# EAGLE design IncubaLibre (EAGLE 6.5.0)
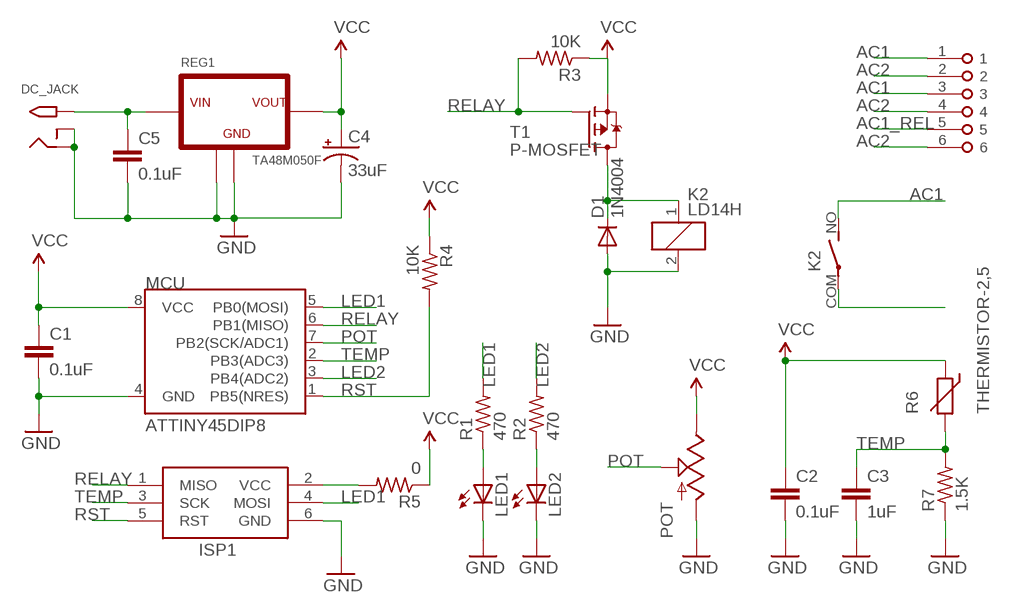
[diagram p0: schematic, sheet 1]

## Parts
AC  TERMINAL-6  [MBE-156]
C1  0.1uF  CAPPTH  [CAP-PTH-SMALL]
C2  0.1uF  CAPPTH  [CAP-PTH-SMALL]
C3  1uF  CAPPTH  [CAP-PTH-SMALL]
C4  33uF  CAP_POLPTH2  [CPOL-RADIAL-10UF-25V]
C5  0.1uF  CAPPTH  [CAP-PTH-SMALL]
D1  1N4004  [DO41-10]
DC_JACK  2.1MMJACKTHM  [PJ-102A]
ISP1  AVRISP-6  [AVRISP]
K2  LD14H  [LD]
LED1  LED5MM  [LED5MM]
LED2  LED5MM  [LED5MM]
MCU  ATTINY45DIP8  [DIP08]
POT  POTTRIM  [TRIM_POT]
R1  470  R-US_0204/7  [0204/7]
R2  470  R-US_0204/7  [0204/7]
R3  10K  R-US_0204/7  [0204/7]
R4  10K  R-US_0204/7  [0204/7]
R5  0  R-US_0204/7  [0204/7]
R6  THERMISTOR-2,5  [RS-2,5]
R7  1.5K  R-US_0204/7  [0204/7]
REG1  TA48M050F  REGULATOR-TO-220  [TO-220]
T1  P-MOSFET  [TO92-]

## Nets
AC1: AC.1 AC.3 K2.NO(2:S)
AC1_REL: AC.5 K2.COM(2:P)
AC2: AC.2 AC.4 AC.6
GND: C1.2 C2.2 C3.2 C4.2(-) C5.2 D1.A DC_JACK.RING DC_JACK.RING_SW ISP1.6(GND) K2.2 LED1.K(C) LED2.K(C) MCU.4(GND) POT.3(A) R7.1 REG1.CENTER(GND) REG1.THERMAL(GND)
LED1: ISP1.4(MOSI) MCU.5(PB0(MOSI)) R1.2
LED2: MCU.3(PB4(ADC2)) R2.2
N$1: ISP1.2(VCC) R5.2
N$2: LED1.A R1.1
N$5: LED2.A R2.1
N$9: C5.1 DC_JACK.TIP REG1.LEFT(VIN)
POT: MCU.7(PB2(SCK/ADC1)) POT.1(S)
RELAY: ISP1.1(MISO) MCU.6(PB1(MISO)) R3.2 T1.2(G)
RST: ISP1.5(RST) MCU.1(PB5(NRES)) R4.2
T1: D1.C K2.1 T1.1(D)
TEMP: C3.1 ISP1.3(SCK) MCU.2(PB3(ADC3)) R6.2 R7.2
VCC: C1.1 C2.1 C4.1(+) MCU.8(VCC) POT.2(E) R3.1 R4.1 R5.1 R6.1 REG1.RIGHT(VOUT) T1.3(S)

## Library data of the parts
AC = Robin:TERMINAL-6
C1-C3 C5 = SparkFun:CAP: Capacitor Standard 0603 ceramic capacitor, and 0.1" leaded capacitor.
C4 = SparkFun:CAP_POL: Capacitor Polarized These are standard SMD and PTH capacitors. Normally 10uF, 47uF, and 100uF in electrolytic and tantalum varieties. Always verify the external diameter of the through hole cap, it varies with capacity, voltage, and manufacturer. The EIA devices should be standard.
D1 = adafruit:1N4004: DIODE General purpose 1N400x type rectifier (With bigger pads) http://www.ladyada.net/library/pcb/eaglelibrary.html
DC_JACK = adafruit:2.1MMJACK: 2.1mm x 5.5mm THM DC jack with internal switch. Digikey part #PJ-102A, 4UCON part #05537 2.1mm x 5.5mm SMT DC jack with internal switch. Digikey part #PJ-002A-SMT, 4UCON part #03267 By microbuilder.eu & adafruit.com
ISP1 = adafruit:AVRISP: AVR ISP HEADER Standard 6 pin header for AVR programming
K2 = relay:LD?*: Slim Power Relay NAiS Source: http://www.mew-europe.com/.. en_ds_61112_0000.pdf; OC_FARNELL: unknown; OC_NEWARK: unknown
LED1 LED2 = adafruit:LED: LED OSRAM: - CHIPLED LG R971, LG N971, LY N971, LG Q971, LY Q971, LO R971, LY R971 LH N974, LH R974 LS Q976, LO Q976, LY Q976 LO Q996 - Hyper CHIPLED LW Q18S LB Q993, LB Q99A, LB R99A - SideLED LS A670, LO A670, LY A670, LG A670, LP A670 LB A673, LV A673, LT A673, LW A673 LH A674 LY A675 LS A676, LA A676, LO A676, LY A676, LW A676 LS A679, LY A679, LG A679 - Hyper Micro SIDELED® LS Y876, LA Y876, LO Y876, LY Y876 LT Y87S - SmartLED LW L88C, LW L88S LB L89C, LB L89S, LG L890 LS L89K, LO L89K, LY L89K LS L896, LA L896, LO L896, LY L896 - TOPLED LS T670, LO T670, LY T670, LG T670, LP T670 LSG T670, LSP T670, LSY T670, LOP T670, LYG T670 LG T671, LOG T671, LSG T671 LB T673, LV T673, LT T673, LW T673 LH T674 LS T676, LA T676, LO T676, LY T676, LB T676, LH T676, LSB T676, LW T676 LB T67C, LV T67C, LT T67C, LS T67K, LO T67K, LY T67K, LW E67C LS E67B, LA E67B, LO E67B, LY E67B, LB E67C, LV E67C, LT E67C LW T67C LS T679, LY T679, LG T679 LS T770, LO T770, LY T770, LG T770, LP T770 LB T773, LV T773, LT T773, LW T773 LH T774 LS E675, LA E675, LY E675, LS T675 LS T776, LA T776, LO T776, LY T776, LB T776 LHGB T686 LT T68C, LB T68C - Hyper Mini TOPLED® LB M676 - Mini TOPLED Santana® LG M470 LS M47K, LO M47K, LY M47K Source: http://www.osram.convergy.de/
MCU = SparkFun:ATTINY45: Atmel ATTiny45
POT = SparkFun:POT
R1-R5 R7 = resistor:R-US_: RESISTOR, American symbol
R6 = varistor:THERMISTOR: THERMISTOR
REG1 = Robin:REGULATOR
T1 = Robin:P-MOSFET

## Board
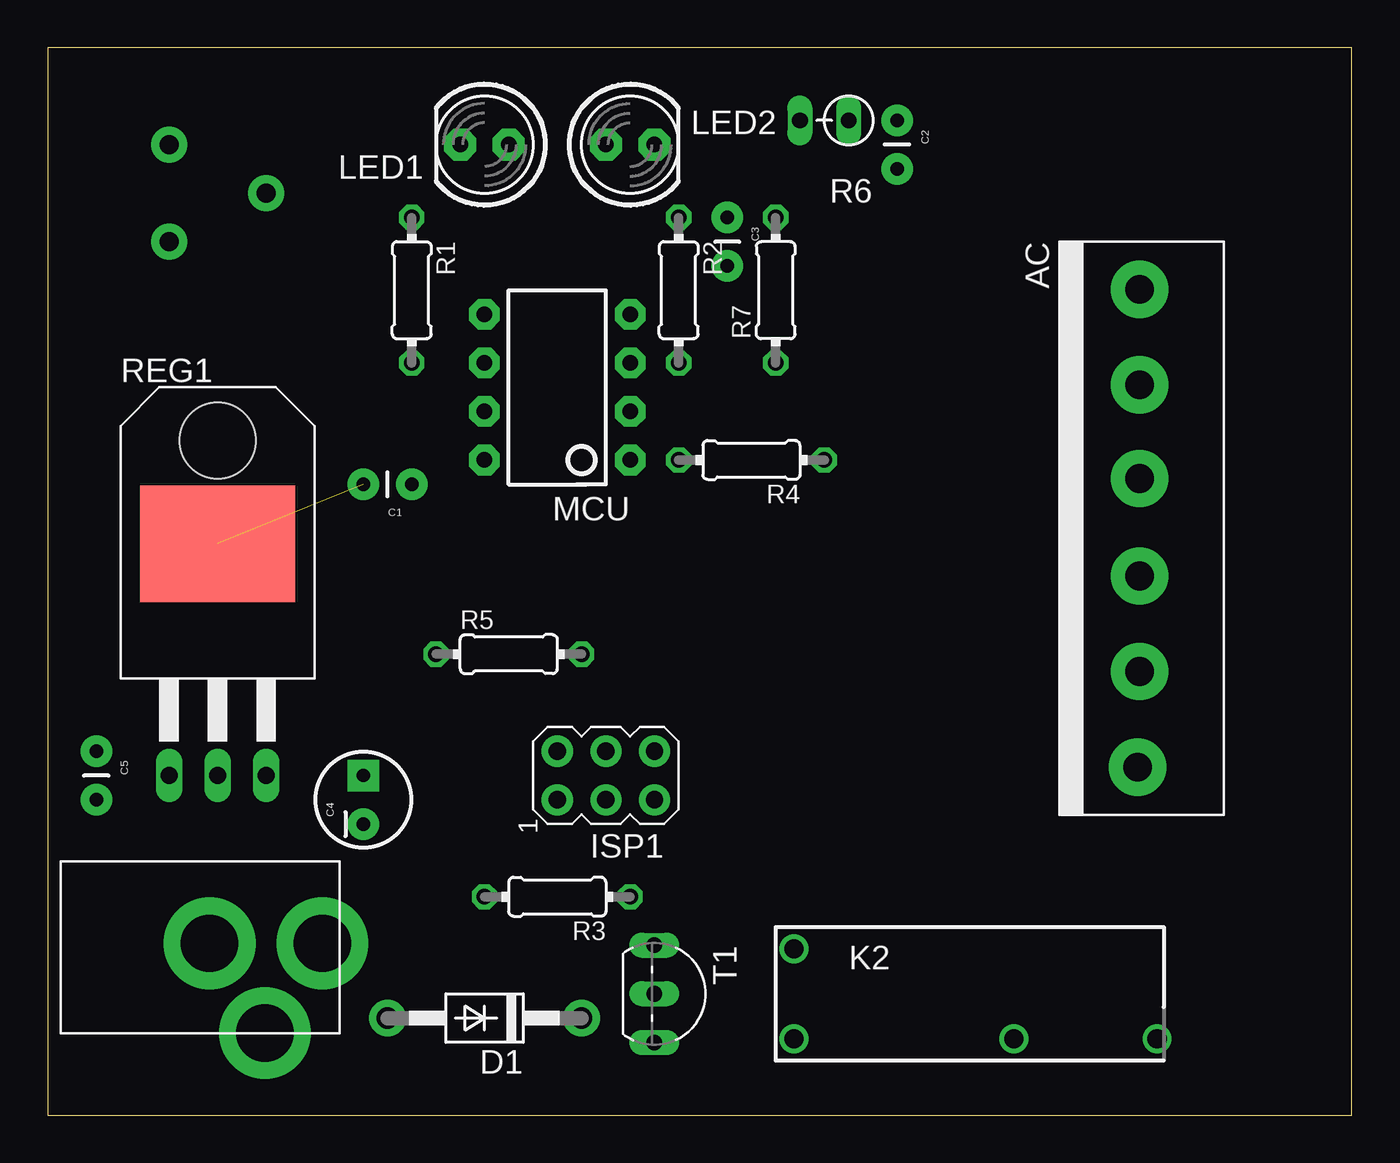
[diagram p1: board, top side]
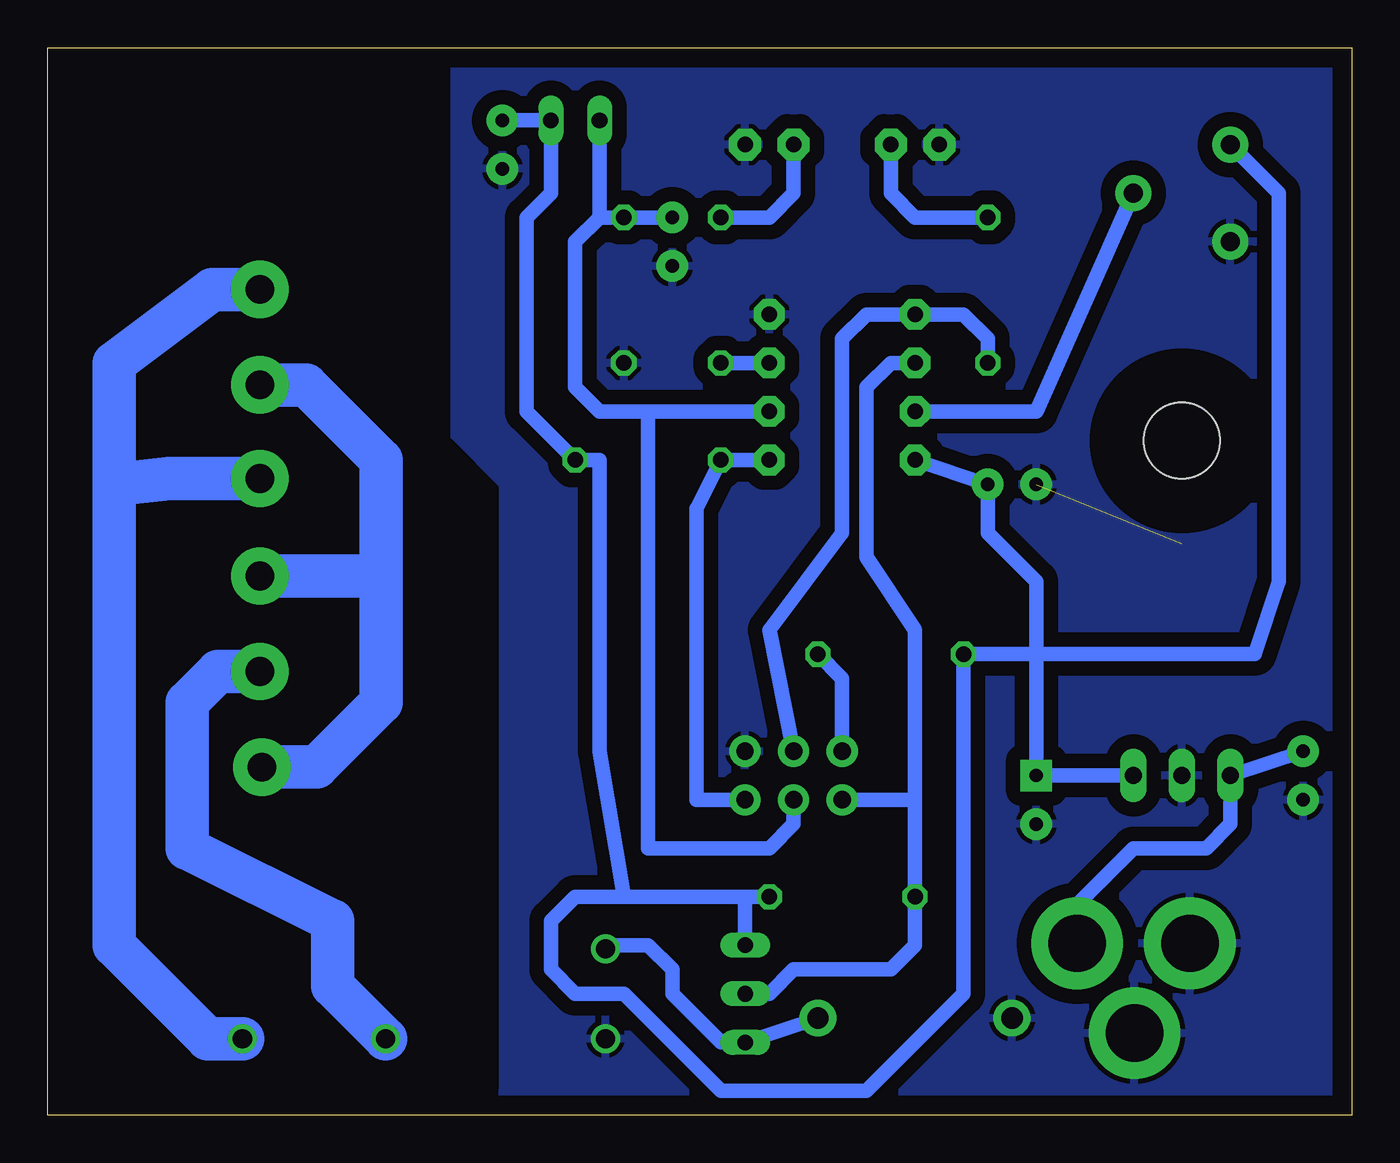
[diagram p2: board, bottom side, seen from below]

Size 68.25 x 55.87 mm. Coordinates in mm from the lower left corner, seen from the top.
Outline: 0,0 68.25,0 68.25,55.87 0,55.87 0,0
Copper layers (1*16): Top 0.035mm / dielectric 1.5mm / Bottom 0.035mm
Design rules "default": minimum track width 10mil, minimum drill 24mil, track to track 8mil, track to pad 8mil, pad to pad 8mil, via to via 8mil, smd to smd 8mil, copper to edge 40mil, drill to drill 8mil, minimum pad ring 10mil, minimum via ring 8mil, stop-mask expansion 4mil, vias tented up to drill 0mil, thermal gap 10mil

### Footprints (pad centres in the part's own frame; a part is rotated, then mirrored left to right if it is on the bottom)
MBE-156 = drill 1.5 pad 3: 1 2.5,0; 2 7.5,0; 3 12.4,0; 4 17.5,0; 5 22.5,0; 6 27.5,-0.1
CAP-PTH-SMALL = drill 0.7 pad 1.651: 1 0,0; 2 2.54,0
CPOL-RADIAL-10UF-25V = drill 0.7 pad 1.651 square: 1 1.27,0 | drill 0.7 pad 1.651: 2 -1.27,0
DO41-10 = drill 1.118 pad 1.93: A 5.08,0; C -5.08,0
PJ-102A = drill 3 pad 4.8: RING 0.1,-3.39; RING_SW -4.6,-6.29; TIP 0.1,-9.29
AVRISP = drill 0.9 pad 1.626: 1 -1.27,2.54; 2 1.27,2.54; 3 -1.27,0; 4 1.27,0; 5 -1.27,-2.54; 6 1.27,-2.54
LD = drill 1: 1 -9.2,2.35; 2 -9.2,-2.35; COM 2.3,-2.35; NO 9.8,-2.35
LED5MM = drill 0.813 pad 1.676 octagon: A -1.27,0; K 1.27,0
DIP08 = drill 0.813 pad 1.6 octagon: 1 -3.81,-3.81; 2 -1.27,-3.81; 3 1.27,-3.81; 4 3.81,-3.81; 5 3.81,3.81; 6 1.27,3.81; 7 -1.27,3.81; 8 -3.81,3.81
TRIM_POT = drill 1 pad 1.88: 1 5.08,0; 2 0,2.54; 3 0,-2.54
0204/7 = drill 0.813 octagon: 1 -3.81,0; 2 3.81,0
RS-2,5 = drill 0.813 long: 1 -1.27,0; 2 1.27,0
TO-220 = drill 0.889 long: CENTER 5.08,-5.08; LEFT 2.54,-5.08; RIGHT 7.62,-5.08 | smd 8.128 x 6.096: THERMAL 5.08,7.048 | hole 3.962: 5.08,12.446
TO92- = drill 0.813 long: 1 2.54,0; 2 0,0; 3 -2.54,0

### Placement (x,y rotation side)
AC  57.15,45.72 270 top
C1  19.05,33.02 180 top
C2  44.45,52.07 270 top
C3  35.56,46.99 270 top
C4  16.51,16.51 90 top
C5  2.54,19.05 270 top
D1  22.86,5.08 180 top
DC_JACK  5.08,8.89 90 top
ISP1  29.21,17.78 90 top
K2  48.26,6.35 0 top
LED1  22.86,50.8 180 top
LED2  30.48,50.8 0 top
MCU  26.67,38.1 90 top
POT  6.35,48.26 0 top
R1  19.05,43.18 270 top
R2  33.02,43.18 270 top
R3  26.67,11.43 180 top
R4  36.83,34.29 180 top
R5  24.13,24.13 0 top
R6  40.64,52.07 180 top
R7  38.1,43.18 90 top
REG1  3.81,22.86 0 top
T1  31.75,6.35 270 top

### Tracks (layer width: path | path; a pad name or v marks a point on that pad's centre or on a via)
AC1
  Bottom 2.286: AC.1 59.65,43.22 64.77,39.37 64.77,33.02 | 64.77,33.02 64.77,8.89 59.88,4 K2.NO | AC.3 61.93,33.32 64.77,33.02
AC1_REL
  Bottom 2.286: AC.5 59.33,23.22 60.96,21.59 60.96,13.97 53.34,10.16 53.34,6.78 K2.COM
AC2
  Bottom 2.286: 50.8,27.94 50.8,21.59 54.17,18.22 AC.6 | AC.4 51.08,28.22 50.8,27.94 | AC.2 54.73,38.22 50.8,34.29 50.8,27.94
GND  (1 unrouted)
  pour Bottom (isolate 0.762): -2.54,58.42 46.99,58.42 46.99,35.56 44.45,33.02 44.45,1.27 46.99,-1.27 -2.54,-1.27
LED1
  Bottom 0.762: R1.2 19.05,40.64 20.32,41.91 MCU.5 25.4,41.91 26.67,40.64 26.67,30.48 30.48,25.4 ISP1.4
LED2
  Bottom 0.762: MCU.3 R2.2
N$1
  Bottom 0.762: ISP1.2 26.67,22.86 R5.2
N$2
  Bottom 0.762: R1.1 22.86,46.99 24.13,48.26 LED1.A
N$5
  Bottom 0.762: R2.1 30.48,46.99 29.21,48.26 LED2.A
N$9
  Bottom 0.762: C5.1 REG1.LEFT 6.35,15.24 7.62,13.97 11.43,13.97 14.37,11.03 DC_JACK.TIP
POT
  Bottom 0.762: MCU.7 16.51,36.83 POT.1
RELAY
  Bottom 0.762: MCU.6 24.13,39.37 25.4,38.1 25.4,29.21 22.86,25.4 22.86,16.51 | 22.86,16.51 R3.2 22.86,8.89 24.13,7.62 29.21,7.62 30.48,6.35 T1.2 | ISP1.1 22.86,16.51
RST
  Bottom 0.762: MCU.1 R4.2 34.29,31.75 34.29,16.51 ISP1.5
T1
  Bottom 0.762: D1.C T1.1 33.02,3.81 35.56,6.35 35.56,7.62 36.83,8.89 38.87,8.89 K2.1
TEMP
  Bottom 0.762: MCU.2 36.83,36.83 | ISP1.3 29.21,15.24 30.48,13.97 36.83,13.97 36.83,36.83 | 36.83,36.83 39.37,36.83 40.64,38.1 40.64,45.72 39.37,46.99 | 39.37,46.99 R7.2 C3.1 | R6.2 39.37,46.99
VCC
  Bottom 0.762: MCU.8 C1.1 19.05,30.48 16.51,27.94 16.51,24.13 | REG1.RIGHT C4.1 16.51,24.13 | R3.1 31.75,11.43 | 31.75,11.43 38.1,11.43 | 38.1,11.43 39.37,19.05 39.37,34.29 R4.1 43.18,36.83 43.18,46.99 41.91,48.26 R6.1 C2.1 | POT.2 3.81,48.26 3.81,27.94 5.08,24.13 16.51,24.13 | 16.51,24.13 R5.1 20.32,6.35 25.4,1.27 33.02,1.27 38.1,6.35 40.64,6.35 41.91,7.62 41.91,10.16 40.64,11.43 38.1,11.43 | T1.3 31.75,11.43